# EAGLE design ardIOExp (EAGLE 7.2.0)
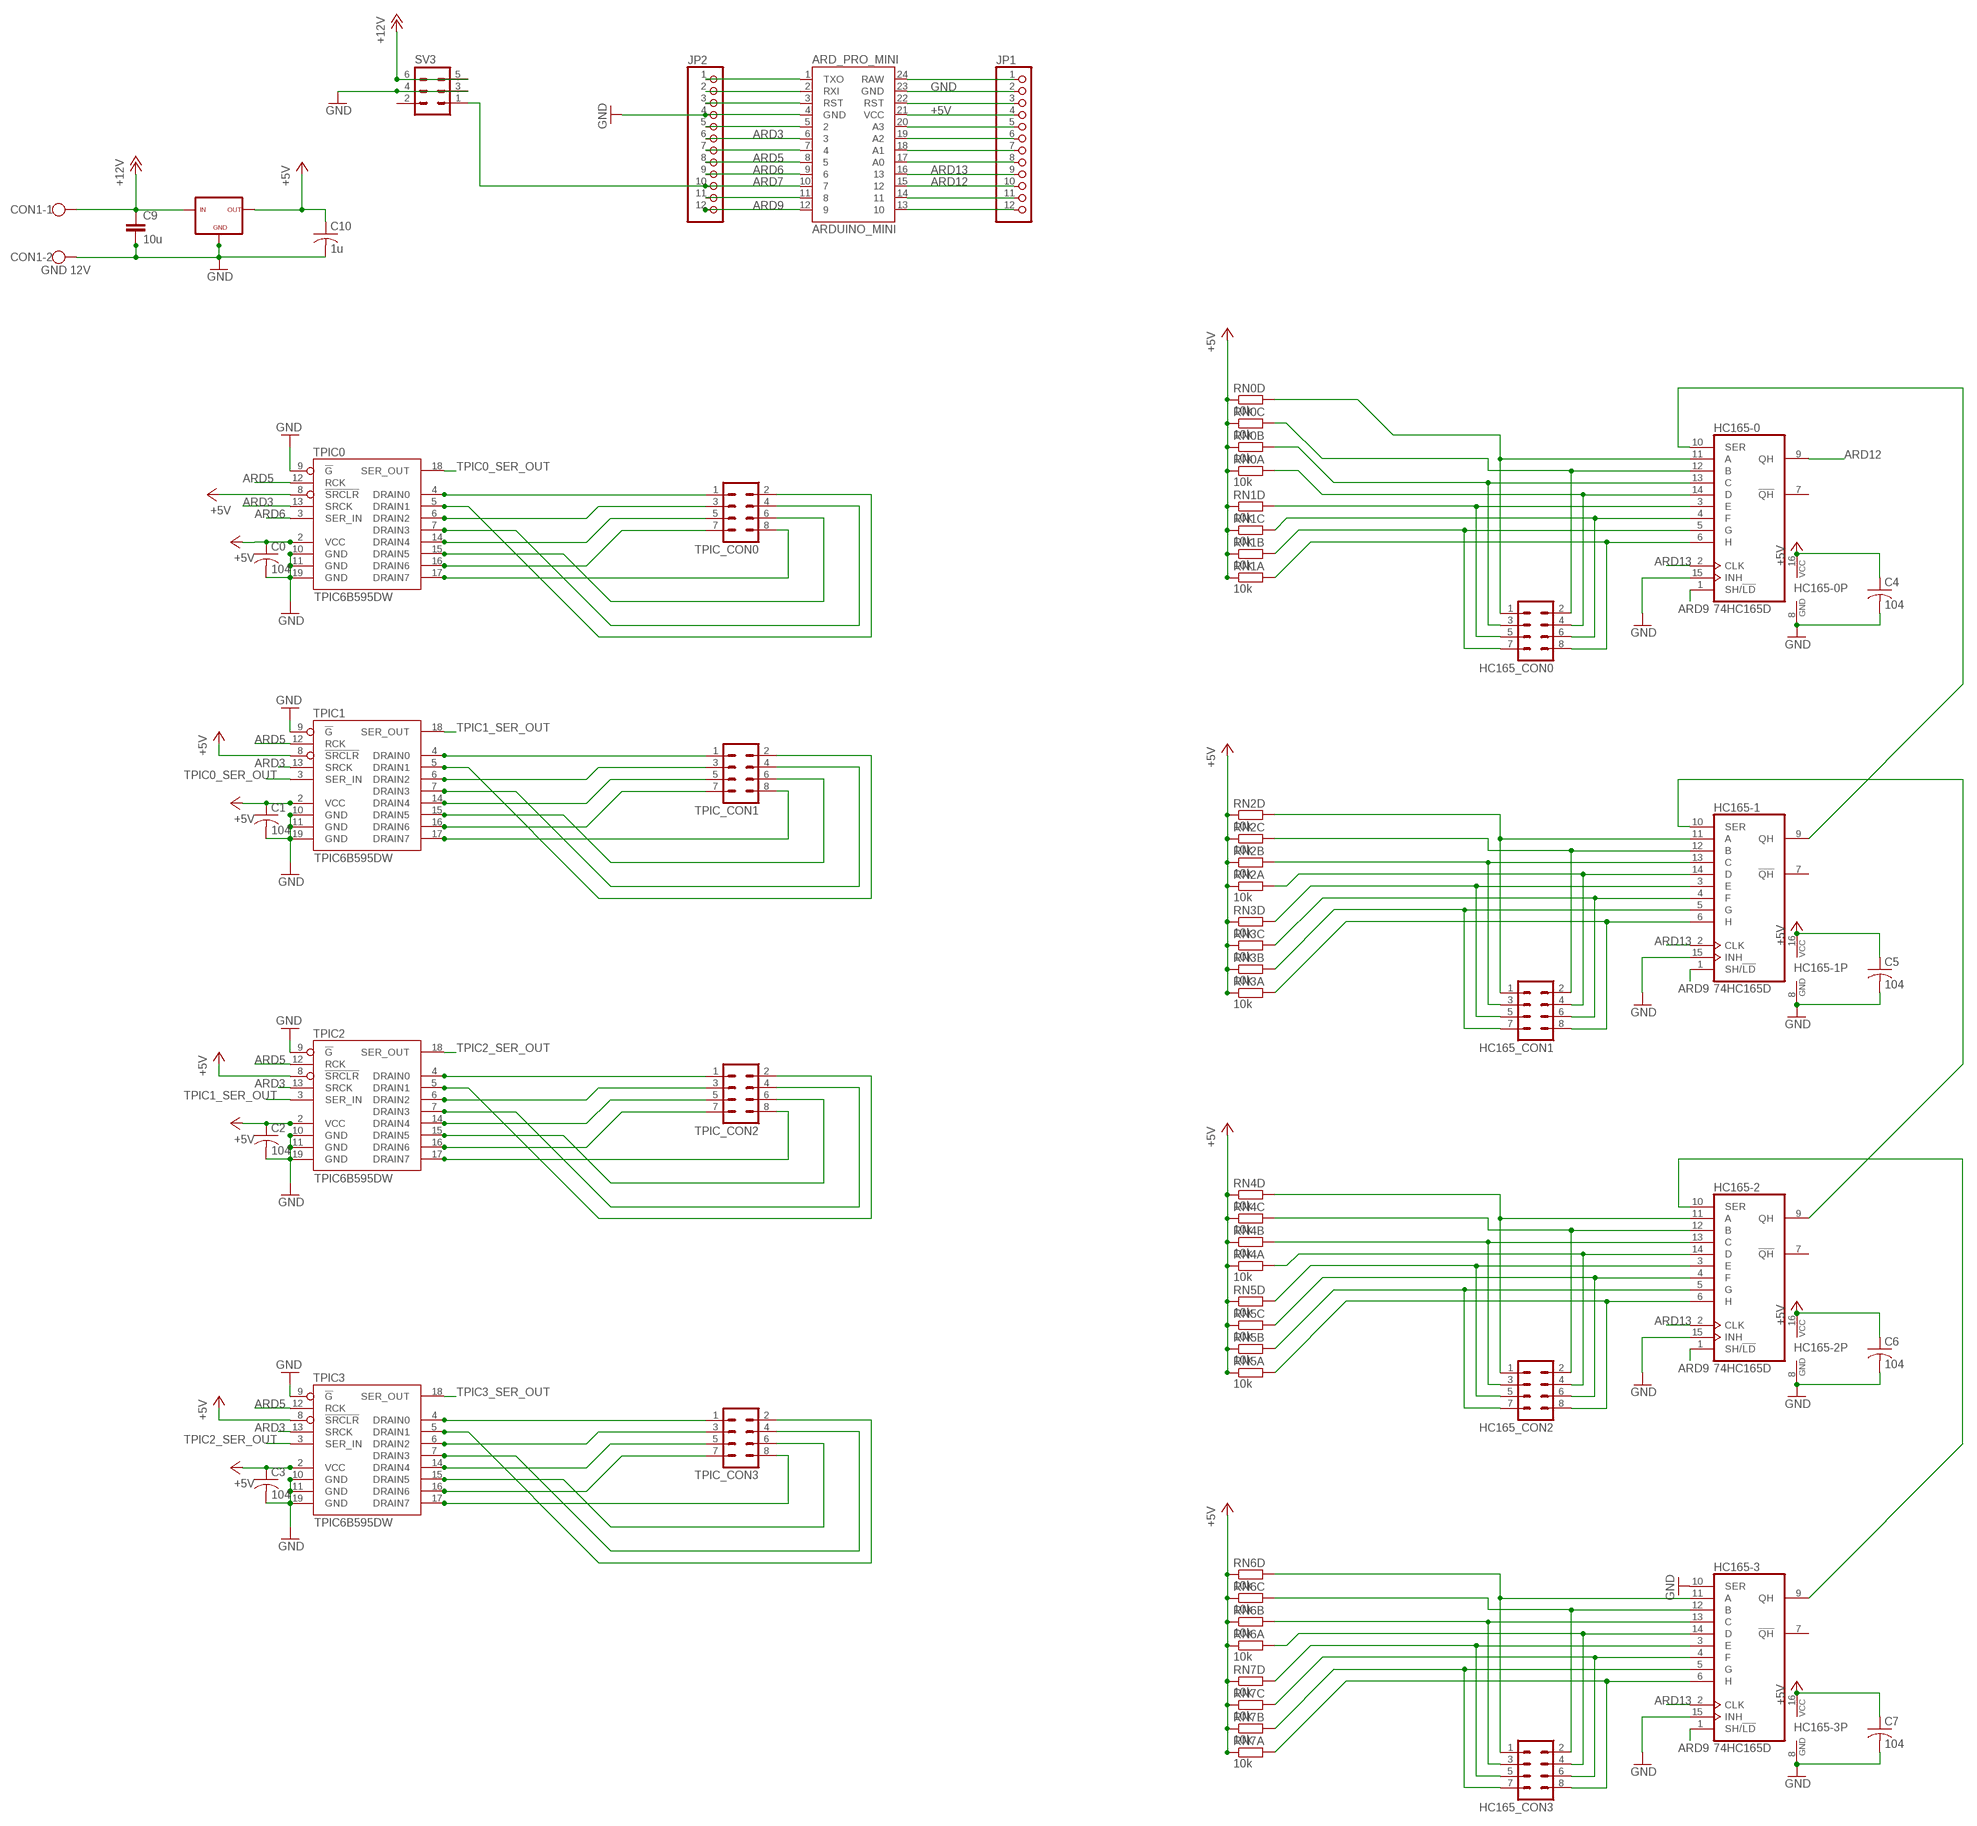
[diagram p0: schematic, sheet 1]

## Parts
ARD_PRO_MINI  ARDUINO_MINI  [ARDUINO_MINI]
C0  104  C-USC0603  [C0603]
C1  104  C-USC0603  [C0603]
C2  104  C-USC0603  [C0603]
C3  104  C-USC0603  [C0603]
C4  104  C-USC0603  [C0603]
C5  104  C-USC0603  [C0603]
C6  104  C-USC0603  [C0603]
C7  104  C-USC0603  [C0603]
C9  10u  C-EU050-024X044  [C050-024X044]
C10  1u  C-USC0805  [C0805]
CON1  GND 12V  W237-102  [W237-102]
HC165-0  74HC165D  [SO16]
HC165-1  74HC165D  [SO16]
HC165-2  74HC165D  [SO16]
HC165-3  74HC165D  [SO16]
HC165_CON0  MA04-2  [MA04-2]
HC165_CON1  MA04-2  [MA04-2]
HC165_CON2  MA04-2  [MA04-2]
HC165_CON3  MA04-2  [MA04-2]
JP1  PINHD-1X12-CB  [1X12-CB]
JP2  PINHD-1X12-CB  [1X12-CB]
RN0  10k  RESISTOR_ARRAY_4  [RN8P-4R-CRA06S]
RN1  10k  RESISTOR_ARRAY_4  [RN8P-4R-CRA06S]
RN2  10k  RESISTOR_ARRAY_4  [RN8P-4R-CRA06S]
RN3  10k  RESISTOR_ARRAY_4  [RN8P-4R-CRA06S]
RN4  10k  RESISTOR_ARRAY_4  [RN8P-4R-CRA06S]
RN5  10k  RESISTOR_ARRAY_4  [RN8P-4R-CRA06S]
RN6  10k  RESISTOR_ARRAY_4  [RN8P-4R-CRA06S]
RN7  10k  RESISTOR_ARRAY_4  [RN8P-4R-CRA06S]
SV3  MA03-2  [MA03-2]
TPIC0  TPIC6B595DW  [SO20W]
TPIC1  TPIC6B595DW  [SO20W]
TPIC2  TPIC6B595DW  [SO20W]
TPIC3  TPIC6B595DW  [SO20W]
TPIC_CON0  MA04-2  [MA04-2]
TPIC_CON1  MA04-2  [MA04-2]
TPIC_CON2  MA04-2  [MA04-2]
TPIC_CON3  MA04-2  [MA04-2]
V_REG_5V  L78D2TT  [D2PAK]

## Nets
+5V: ARD_PRO_MINI.21(VCC) C0.1 C1.1 C2.1 C3.1 C4.1 C5.1 C6.1 C7.1 C10.1 HC165-0.16(VCC) HC165-1.16(VCC) HC165-2.16(VCC) HC165-3.16(VCC) JP1.4 RN0.1 RN0.2 RN0.3 RN0.4 RN1.1 RN1.2 RN1.3 RN1.4 RN2.1 RN2.2 RN2.3 RN2.4 RN3.1 RN3.2 RN3.3 RN3.4 RN4.1 RN4.2 RN4.3 RN4.4 RN5.1 RN5.2 RN5.3 RN5.4 RN6.1 RN6.2 RN6.3 RN6.4 RN7.1 RN7.2 RN7.3 RN7.4 TPIC0.2(VCC) TPIC0.8(!SRCLR) TPIC1.2(VCC) TPIC1.8(!SRCLR) TPIC2.2(VCC) TPIC2.8(!SRCLR) TPIC3.2(VCC) TPIC3.8(!SRCLR) V_REG_5V.3(OUT)
+12V: C9.1 CON1.1 SV3.5 SV3.6 V_REG_5V.1(IN)
ARD3: ARD_PRO_MINI.6 JP2.6 TPIC0.13(SRCK) TPIC1.13(SRCK) TPIC2.13(SRCK) TPIC3.13(SRCK)
ARD5: ARD_PRO_MINI.8 JP2.8 TPIC0.12(RCK) TPIC1.12(RCK) TPIC2.12(RCK) TPIC3.12(RCK)
ARD6: ARD_PRO_MINI.9 JP2.9 TPIC0.3(SER_IN)
ARD7: ARD_PRO_MINI.10 JP2.10 SV3.1
ARD9: ARD_PRO_MINI.12 HC165-0.1(SH/!LD) HC165-1.1(SH/!LD) HC165-2.1(SH/!LD) HC165-3.1(SH/!LD) JP2.12
ARD12: ARD_PRO_MINI.15 HC165-0.9(QH) JP1.10
ARD13: ARD_PRO_MINI.16 HC165-0.2(CLK) HC165-1.2(CLK) HC165-2.2(CLK) HC165-3.2(CLK) JP1.9
GND: ARD_PRO_MINI.4(GND) ARD_PRO_MINI.23(GND) C0.2 C1.2 C2.2 C3.2 C4.2 C5.2 C6.2 C7.2 C9.2 C10.2 CON1.2 HC165-0.8(GND) HC165-0.15(INH) HC165-1.8(GND) HC165-1.15(INH) HC165-2.8(GND) HC165-2.15(INH) HC165-3.8(GND) HC165-3.10(SER) HC165-3.15(INH) JP1.2 JP2.4 SV3.3 SV3.4 TPIC0.9(!G) TPIC0.10(GND) TPIC0.11(GND) TPIC0.19(GND) TPIC1.9(!G) TPIC1.10(GND) TPIC1.11(GND) TPIC1.19(GND) TPIC2.9(!G) TPIC2.10(GND) TPIC2.11(GND) TPIC2.19(GND) TPIC3.9(!G) TPIC3.10(GND) TPIC3.11(GND) TPIC3.19(GND) V_REG_5V.2(GND)
N$2: TPIC0.4(DRAIN0) TPIC_CON0.1
N$3: TPIC0.5(DRAIN1) TPIC_CON0.2
N$5: TPIC0.6(DRAIN2) TPIC_CON0.3
N$6: TPIC0.7(DRAIN3) TPIC_CON0.4
N$7: TPIC0.14(DRAIN4) TPIC_CON0.5
N$8: TPIC0.16(DRAIN6) TPIC_CON0.7
N$9: TPIC0.15(DRAIN5) TPIC_CON0.6
N$10: TPIC0.17(DRAIN7) TPIC_CON0.8
N$11: TPIC1.4(DRAIN0) TPIC_CON1.1
N$12: TPIC1.5(DRAIN1) TPIC_CON1.2
N$13: TPIC1.6(DRAIN2) TPIC_CON1.3
N$14: TPIC1.7(DRAIN3) TPIC_CON1.4
N$15: TPIC1.14(DRAIN4) TPIC_CON1.5
N$16: TPIC1.16(DRAIN6) TPIC_CON1.7
N$17: TPIC1.15(DRAIN5) TPIC_CON1.6
N$18: TPIC1.17(DRAIN7) TPIC_CON1.8
N$19: TPIC2.4(DRAIN0) TPIC_CON2.1
N$21: TPIC2.6(DRAIN2) TPIC_CON2.3
N$22: TPIC2.7(DRAIN3) TPIC_CON2.4
N$23: TPIC2.5(DRAIN1) TPIC_CON2.2
N$25: TPIC2.16(DRAIN6) TPIC_CON2.7
N$26: HC165-0.5(G) HC165_CON0.7 RN1.7
N$29: TPIC3.6(DRAIN2) TPIC_CON3.3
N$31: TPIC2.14(DRAIN4) TPIC_CON2.5
N$32: TPIC2.15(DRAIN5) TPIC_CON2.6
N$33: TPIC2.17(DRAIN7) TPIC_CON2.8
N$34: HC165-0.3(E) HC165_CON0.5 RN1.5
N$36: HC165-0.6(H) HC165_CON0.8 RN1.8
N$37: HC165-0.13(C) HC165_CON0.3 RN0.7
N$38: HC165-0.12(B) HC165_CON0.2 RN0.6
N$39: HC165-0.14(D) HC165_CON0.4 RN0.8
N$40: ARD_PRO_MINI.1(TXO) JP2.1
N$41: HC165-0.11(A) HC165_CON0.1 RN0.5
N$42: ARD_PRO_MINI.7 JP2.7
N$43: HC165-1.11(A) HC165_CON1.1 RN2.5
N$44: HC165-1.12(B) HC165_CON1.2 RN2.6
N$45: HC165-1.13(C) HC165_CON1.3 RN2.7
N$46: HC165-1.14(D) HC165_CON1.4 RN2.8
N$47: HC165-1.3(E) HC165_CON1.5 RN3.5
N$48: HC165-1.4(F) HC165_CON1.6 RN3.6
N$49: HC165-2.11(A) HC165_CON2.1 RN4.5
N$50: HC165-2.14(D) HC165_CON2.4 RN4.8
N$51: HC165-0.10(SER) HC165-1.9(QH)
N$53: HC165-2.12(B) HC165_CON2.2 RN4.6
N$54: HC165-2.13(C) HC165_CON2.3 RN4.7
N$56: HC165-2.3(E) HC165_CON2.5 RN5.5
N$57: HC165-2.4(F) HC165_CON2.6 RN5.6
N$58: HC165-1.10(SER) HC165-2.9(QH)
N$59: HC165-2.10(SER) HC165-3.9(QH)
N$60: HC165-3.14(D) HC165_CON3.4 RN6.8
N$61: HC165-3.11(A) HC165_CON3.1 RN6.5
N$62: HC165-3.12(B) HC165_CON3.2 RN6.6
N$63: HC165-3.13(C) HC165_CON3.3 RN6.7
N$64: HC165-3.5(G) HC165_CON3.7 RN7.7
N$65: HC165-3.6(H) HC165_CON3.8 RN7.8
N$67: HC165-3.3(E) HC165_CON3.5 RN7.5
N$68: HC165-3.4(F) HC165_CON3.6 RN7.6
N$70: TPIC3.7(DRAIN3) TPIC_CON3.4
N$71: TPIC3.5(DRAIN1) TPIC_CON3.2
N$72: TPIC3.4(DRAIN0) TPIC_CON3.1
N$73: TPIC3.15(DRAIN5) TPIC_CON3.6
N$74: TPIC3.14(DRAIN4) TPIC_CON3.5
N$75: TPIC3.16(DRAIN6) TPIC_CON3.7
N$76: TPIC3.17(DRAIN7) TPIC_CON3.8
N$77: ARD_PRO_MINI.2(RXI) JP2.2
N$78: ARD_PRO_MINI.3(RST) JP2.3
N$80: ARD_PRO_MINI.5 JP2.5
N$82: HC165-1.5(G) HC165_CON1.7 RN3.7
N$83: ARD_PRO_MINI.11 JP2.11
N$84: ARD_PRO_MINI.24(RAW) JP1.1
N$85: ARD_PRO_MINI.22(RST) JP1.3
N$87: HC165-0.4(F) HC165_CON0.6 RN1.6
N$88: ARD_PRO_MINI.20(A3) JP1.5
N$89: ARD_PRO_MINI.19(A2) JP1.6
N$90: ARD_PRO_MINI.18(A1) JP1.7
N$91: ARD_PRO_MINI.17(A0) JP1.8
N$92: ARD_PRO_MINI.14 JP1.11
N$93: ARD_PRO_MINI.13 JP1.12
N$95: HC165-2.5(G) HC165_CON2.7 RN5.7
N$96: HC165-2.6(H) HC165_CON2.8 RN5.8
N$97: HC165-1.6(H) HC165_CON1.8 RN3.8
TPIC0_SER_OUT: TPIC0.18(SER_OUT) TPIC1.3(SER_IN)
TPIC1_SER_OUT: TPIC1.18(SER_OUT) TPIC2.3(SER_IN)
TPIC2_SER_OUT: TPIC2.18(SER_OUT) TPIC3.3(SER_IN)
TPIC3_SER_OUT: TPIC3.18(SER_OUT)
Unconnected: HC165-0.7(!QH) HC165-1.7(!QH) HC165-2.7(!QH) HC165-3.7(!QH) SV3.2

## Library data of the parts
ARD_PRO_MINI = SparkFun-Boards:ARDUINO_MINI: Arduino Pro Mini footprint
C0 C1-C7 C10 = rcl:C-US: CAPACITOR, American symbol
C9 = resistor:C-EU: CAPACITOR, European symbol
CON1 = con-wago-500:W237-102: WAGO SCREW CLAMP; MPN: 237-102; OC_FARNELL: unknown; OC_NEWARK: 70K9898
HC165-0 HC165-1-HC165-3 = 74xx-eu:74*165: 8-bit parallel load SHIFT REGISTER
HC165_CON0 HC165_CON1-HC165_CON3 TPIC_CON0 TPIC_CON1-TPIC_CON3 = con-lstb:MA04-2: PIN HEADER; OC_FARNELL: unknown; OC_NEWARK: unknown
JP1 JP2 = adafruit:PINHD-1X12: PIN HEADER
RN0 RN1-RN7 = dp_devices:RESISTOR_ARRAY_4: 4 Resistor Array 0603
SV3 = con-lstb:MA03-2: PIN HEADER; OC_FARNELL: unknown; OC_NEWARK: unknown
TPIC0 TPIC1-TPIC3 = TPIC6B595:TPIC6B595
V_REG_5V = L78:L78

## Net classes
1 power: width 0.61 mm

## Board
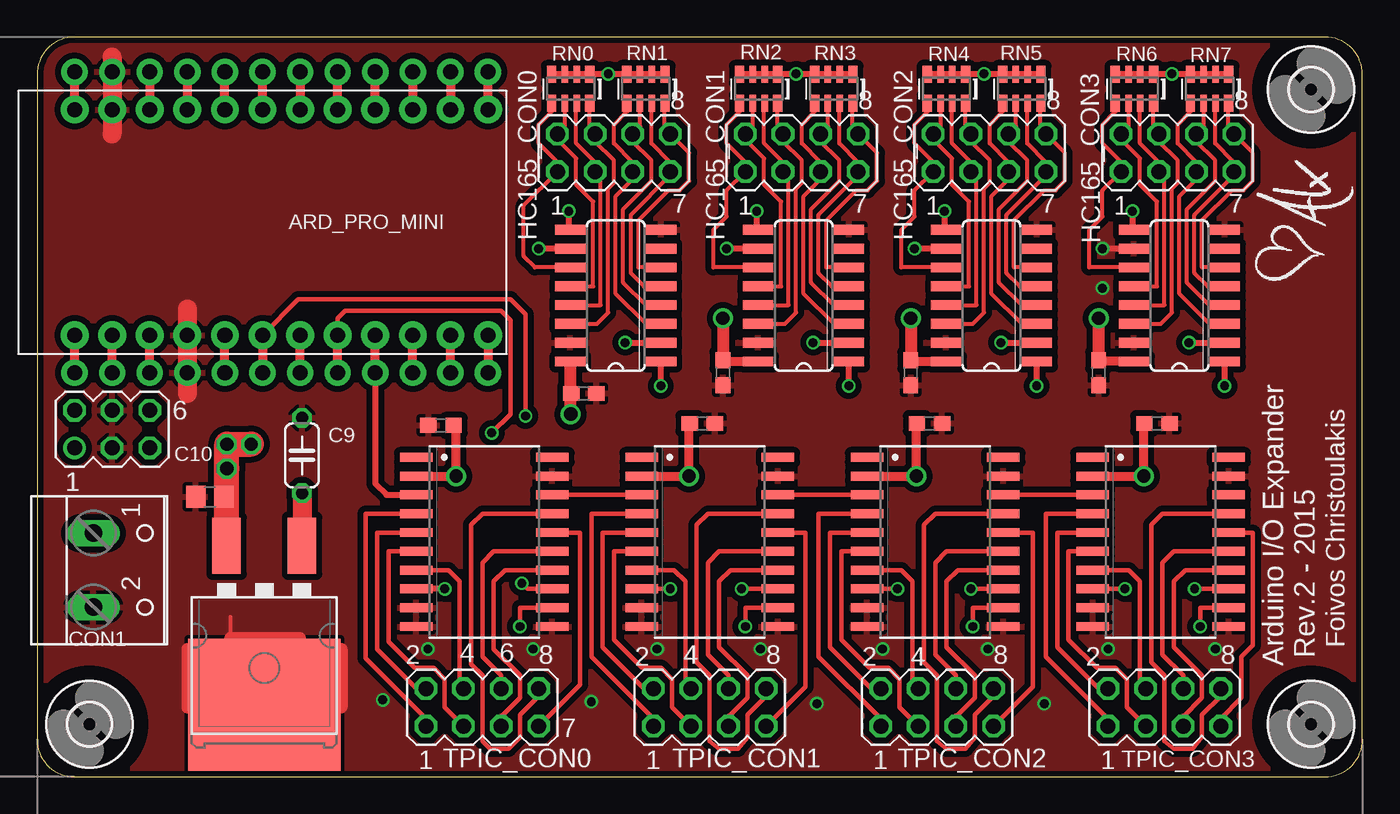
[diagram p1: board, top side]
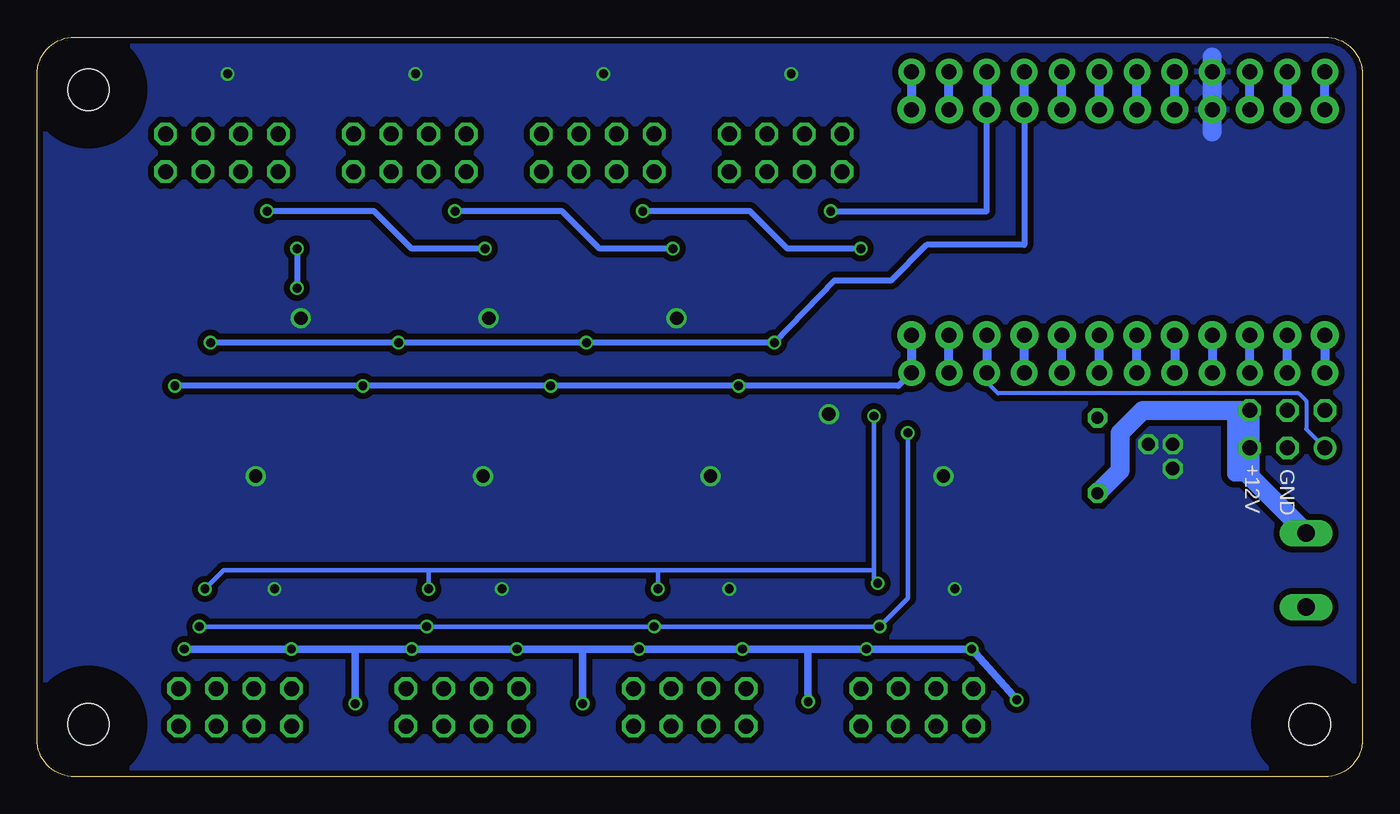
[diagram p2: board, bottom side, seen from below]

Size 89.59 x 49.99 mm. Coordinates in mm from the lower left corner, seen from the top.
Outline: 0,47.45 0,2.54 arc90 2.54,0 87.05,0 arc90 89.59,2.54 89.59,47.45 arc90 87.05,49.99 2.54,49.99 arc90 0,47.45
Copper layers (1*16): Top 0.035mm / dielectric 1.5mm / Bottom 0.035mm
Design rules "ITEADstudio_DRC": minimum track width 6mil, minimum drill 12mil, track to track 6mil, track to pad 6mil, pad to pad 6mil, via to via 6mil, smd to smd 0mil, copper to edge 10mil, drill to drill 10mil, minimum pad ring 10mil, minimum via ring 6mil, stop-mask expansion 2mil, vias tented up to drill 100mil, thermal gap 10mil

### Footprints (pad centres in the part's own frame; a part is rotated, then mirrored left to right if it is on the bottom)
ARDUINO_MINI = drill 1.016 pad 1.88: 1 -7.62,12.7; 2 -7.62,10.16; 3 -7.62,7.62; 4 -7.62,5.08; 5 -7.62,2.54; 6 -7.62,0; 7 -7.62,-2.54; 8 -7.62,-5.08; 9 -7.62,-7.62; 10 -7.62,-10.16; 11 -7.62,-12.7; 12 -7.62,-15.24; 13 7.62,-15.24; 14 7.62,-12.7; 15 7.62,-10.16; 16 7.62,-7.62; 17 7.62,-5.08; 18 7.62,-2.54; 19 7.62,0; 20 7.62,2.54; 21 7.62,5.08; 22 7.62,7.62; 23 7.62,10.16; 24 7.62,12.7
C0603 = smd 1.1 x 1: 1 -0.85,0; 2 0.85,0
C050-024X044 = drill 0.813 octagon: 1 -2.54,0; 2 2.54,0
C0805 = smd 1.3 x 1.5: 1 -0.95,0; 2 0.95,0
W237-102 = drill 1.194 long: 1 -2.5,-1.27; 2 2.5,-1.27
SO16 = smd 0.66 x 2.032: 1 -4.445,-3.073; 2 -3.175,-3.073; 3 -1.905,-3.073; 4 -0.635,-3.073; 5 0.635,-3.073; 6 1.905,-3.073; 7 3.175,-3.073; 8 4.445,-3.073; 9 4.445,3.073; 10 3.175,3.073; 11 1.905,3.073; 12 0.635,3.073; 13 -0.635,3.073; 14 -1.905,3.073; 15 -3.175,3.073; 16 -4.445,3.073
MA04-2 = drill 1.016 octagon: 1 -3.81,-1.27; 2 -3.81,1.27; 3 -1.27,-1.27; 4 -1.27,1.27; 5 1.27,-1.27; 6 1.27,1.27; 7 3.81,-1.27; 8 3.81,1.27
1X12-CB = drill 1.016 pad 1.778: 1 -13.97,0; 2 -11.43,0; 3 -8.89,0; 4 -6.35,0; 5 -3.81,0; 6 -1.27,0; 7 1.27,0; 8 3.81,0; 9 6.35,0; 10 8.89,0; 11 11.43,0; 12 13.97,0
RN8P-4R-CRA06S = smd 0.63 x 1.15: 1 -1.295,-0.975; 4 1.295,-0.975; 5 1.295,0.975; 8 -1.295,0.975 | smd 0.44 x 1.15: 2 -0.4,-0.975; 3 0.4,-0.975; 6 0.4,0.975; 7 -0.4,0.975
MA03-2 = drill 1.016: 1 -2.54,-1.27 | drill 1.016 octagon: 2 -2.54,1.27; 3 0,-1.27; 4 0,1.27; 5 2.54,-1.27; 6 2.54,1.27
SO20W = smd 0.6 x 2.2: 1 -5.715,-4.6; 2 -4.445,-4.6; 3 -3.175,-4.6; 4 -1.905,-4.6; 5 -0.635,-4.6; 6 0.635,-4.6; 7 1.905,-4.6; 8 3.175,-4.6; 9 4.445,-4.6; 10 5.715,-4.6; 11 5.715,4.6; 12 4.445,4.6; 13 3.175,4.6; 14 1.905,4.6; 15 0.635,4.6; 16 -0.635,4.6; 17 -1.905,4.6; 18 -3.175,4.6; 19 -4.445,4.6; 20 -5.715,4.6
2,8 = hole 2.8: 0,0
D2PAK = smd 1.93 x 3.81: 1 -2.55,-8.25; 3 2.55,-8.25 | smd 10.3 x 8.9: 2 0,2.5

### Placement (x,y rotation side)
ARD_PRO_MINI  15.24,37.47 90 top
C0  27.3,23.75 180 top
C1  44.96,23.88 0 top
C2  60.33,23.88 0 top
C3  75.69,23.88 0 top
C4  36.96,25.91 0 top
C5  46.35,27.3 270 top
C6  59.05,27.3 270 top
C7  71.75,27.3 270 top
C9  17.91,21.72 90 top
C10  11.68,18.92 180 top
CON1  5.08,13.97 270 top
HC165-0  39.12,32.51 90 top
HC165-1  51.82,32.51 90 top
HC165-2  64.52,32.51 90 top
HC165-3  77.22,32.51 90 top
HC165_CON0  38.99,42.16 0 top
HC165_CON1  51.69,42.16 0 top
HC165_CON2  64.39,42.16 0 top
HC165_CON3  77.09,42.16 0 top
JP1  16.51,47.62 0 top
JP2  16.51,27.3 0 top
RN0  36.07,46.48 180 top
RN1  41.15,46.48 180 top
RN2  48.77,46.48 180 top
RN3  53.85,46.48 180 top
RN4  61.47,46.48 180 top
RN5  66.55,46.48 180 top
RN6  74.17,46.48 180 top
RN7  79.25,46.48 180 top
SV3  5.08,23.5 0 top
TPIC0  30.23,15.88 270 top
TPIC1  45.47,15.88 270 top
TPIC2  60.71,15.88 270 top
TPIC3  75.95,15.88 270 top
TPIC_CON0  30.1,4.7 0 top
TPIC_CON1  45.47,4.7 0 top
TPIC_CON2  60.83,4.7 0 top
TPIC_CON3  76.2,4.7 0 top
U$1  [2,8]  3.56,3.56 0 top
U$3  [2,8]  86.11,46.43 0 top
U$4  [2,8]  86.11,3.56 0 top
U$6  [HALX2_532_SILKSCREEN]  87,34.16 90 top
U$7  [HALX2_532_TSTOP]  5.59,35.81 0 top
V_REG_5V  15.37,7.37 180 top

### Tracks (layer width: path | path; a pad name or v marks a point on that pad's centre or on a via)
+5V  (via drill 0.6, 0.9)
  Top 0.254: HC165-0.16 36.04,27.96 36.07,27.94 | TPIC0.2 25.78,20.32 | TPIC1.2 40.89,20.32 | 41.02,12.7 TPIC1.8 | TPIC2.2 56.26,20.32 | TPIC2.8 56.39,12.7 | TPIC3.2 71.63,20.32 | TPIC3.8 71.75,12.7 | C0.1 28.32,23.75 | C2.1 59.44,23.88 | 74.8,23.88 C3.1
  Top 0.305: v42.8,12.7 41.02,12.7 | v58.17,12.7 56.39,12.7 | v73.53,12.7 71.75,12.7
  Top 0.406: v27.56,12.7 TPIC0.8 25.4,12.7 | 73.79,47.5 72.9,47.5 72.9,47.46 RN6.4 | 73.79,47.5 74.55,47.5 | 74.55,47.5 75.44,47.5 | 75.44,47.5 v76.71,47.5 77.98,47.5 | 77.98,47.5 78.87,47.5 | 78.87,47.5 79.63,47.5 | 79.63,47.5 80.52,47.5 80.52,47.46 RN7.1 | 61.09,47.5 60.17,47.5 RN4.4 | 61.09,47.5 61.85,47.5 | 61.85,47.5 62.74,47.5 | 62.74,47.5 v64.01,47.5 65.28,47.5 | 65.28,47.5 66.17,47.5 | 66.17,47.5 66.93,47.5 | 66.93,47.5 67.82,47.5 67.82,47.46 RN5.1 | 48.39,47.5 47.47,47.5 RN2.4 | 48.39,47.5 49.15,47.5 | 49.15,47.5 50.04,47.5 | 50.04,47.5 v51.31,47.5 52.58,47.5 | 52.58,47.5 53.47,47.5 | 53.47,47.5 54.23,47.5 | 54.23,47.5 55.14,47.5 RN3.1 | 35.69,47.5 34.77,47.5 RN0.4 | 35.69,47.5 36.45,47.5 | 36.45,47.5 37.21,47.5 | 37.21,47.5 v38.61,47.5 39.88,47.5 | 39.88,47.5 40.64,47.5 | 40.64,47.5 41.53,47.5 | 41.53,47.5 42.44,47.5 RN1.1 | V_REG_5V.3 | C4.1 36.07,25.91 v36.07,24.51 | 44.07,23.88 C1.1 | HC165-3.16 74.04,28.07 | RN7.4 77.98,47.46 77.98,47.5 | RN7.2 79.63,47.46 79.63,47.5 | RN7.3 78.87,47.46 78.87,47.5 | RN6.1 75.44,47.46 75.44,47.5 | RN6.3 73.79,47.46 73.79,47.5 | RN6.2 74.55,47.46 74.55,47.5 | RN5.4 65.28,47.46 65.28,47.5 | RN5.3 66.17,47.46 66.17,47.5 | RN5.2 66.93,47.46 66.93,47.5 | RN4.3 61.09,47.46 61.09,47.5 | RN4.2 61.85,47.46 61.85,47.5 | RN4.1 62.74,47.46 62.74,47.5 | RN2.3 48.39,47.46 48.39,47.5 | RN2.2 49.15,47.46 49.15,47.5 | RN2.1 50.04,47.46 50.04,47.5 | RN0.3 35.69,47.46 35.69,47.5 | RN0.2 36.45,47.46 36.45,47.5 | RN0.1 37.21,47.46 37.21,47.5 | RN1.4 39.88,47.46 39.88,47.5 | RN1.3 40.64,47.46 40.64,47.5 | RN1.2 41.53,47.46 41.53,47.5 | RN3.4 52.58,47.46 52.58,47.5 | RN3.3 53.47,47.46 53.47,47.5 | RN3.2 54.23,47.46 54.23,47.5
  Top 0.61: 40.89,20.32 v44.07,20.32 44.07,23.88 | 25.78,20.32 v28.32,20.32 28.32,23.75 | 56.26,20.32 v59.44,20.32 59.44,23.88 | 71.63,20.32 v74.8,20.32 74.8,23.88 | JP1.4 ARD_PRO_MINI.21 | 61.47,28.07 HC165-2.16 59.05,28.07 59.05,27.94 | 46.35,28.07 HC165-1.16 48.77,28.07 | 74.04,28.07 71.75,28.07
  Top 0.813: v59.05,30.99 C6.1 59.05,28.07 | v46.35,30.99 C5.1 46.35,28.07 | v36.07,24.51 36.07,27.94 | 71.75,28.07 C7.1 v71.75,30.99
  Top 1.27: C10.1 12.7,18.92 v12.83,20.83
  Top 1.676: V_REG_5V.3 v12.83,20.83 v12.83,22.48 v14.48,22.48
  Bottom 1.27: 10.16,43.56 10.16,48.64
  pour Bottom (isolate 0.406, rank 3): 0,2.54 0,47.45 arc-90 2.54,49.99 87.05,49.99 arc-90 89.59,47.45 89.59,2.54 arc-90 87.05,0 2.54,0 arc-90
+12V
  Top 0.406: 17.91,15.62 V_REG_5V.1
  Top 1.27: C9.1 17.91,15.62
  Bottom 0.254: 3.81,16.51 CON1.1
  Bottom 1.016: 7.62,20.45 8.64,20.45 8.64,24.77
  Bottom 1.27: C9.1 16.38,20.7 16.38,23.24 14.86,24.77 8.64,24.77 SV3.6 SV3.5 7.62,20.45 7.62,20.32 3.81,16.51
ARD3  (via drill 0.6)
  Top 0.254: TPIC0.13 34.67,12.7 | 49.91,12.7 TPIC1.13 | TPIC2.13 65.15,12.7 | TPIC3.13 80.39,12.7
  Top 0.305: 80.39,12.7 v78.23,12.7 | v47.62,12.7 49.91,12.7 | v63.12,12.7 65.15,12.7 | v32.77,13.08 33.15,12.7 34.67,12.7 | v33.02,24.38 33.02,31.24 32,32.26 17.65,32.26 ARD_PRO_MINI.6
  Top 0.61: ARD_PRO_MINI.6 JP2.6
  Bottom 0.305: v78.23,12.7 76.96,13.97 63.12,13.97 | 63.12,13.97 47.62,13.97 | 63.12,13.97 v63.12,12.7 | 47.62,13.97 v47.62,12.7 | 47.62,13.97 33.02,13.97 | 33.02,13.97 33.02,13.34 v32.77,13.08 | v33.02,24.38 33.02,13.97
  Bottom 0.61: JP2.6 ARD_PRO_MINI.6
ARD5  (via drill 0.6)
  Top 0.305: 34.92,11.43 TPIC0.12 32.64,11.43 v32.64,10.16 | 50.16,11.43 TPIC1.12 47.88,11.43 v47.88,10.16 | 65.53,11.43 TPIC2.12 63.25,11.43 v63.25,10.16 | 80.9,11.43 TPIC3.12 78.61,11.43 v78.61,10.16 | ARD_PRO_MINI.8 20.32,30.99 20.83,31.5 31.37,31.5 32,30.86 32,24.51 v30.73,23.24
  Top 0.61: JP2.8 ARD_PRO_MINI.8
  Bottom 0.305: v30.73,23.24 30.73,12.06 v32.64,10.16 v47.88,10.16 v63.25,10.16 v78.61,10.16
  Bottom 0.61: JP2.8 ARD_PRO_MINI.8
ARD6
  Top 0.406: JP2.9 22.86,19.81 23.62,19.05 TPIC0.3 25.65,19.05 25.78,19.05
  Top 0.61: JP2.9 ARD_PRO_MINI.9
  Bottom 0.61: JP2.9 ARD_PRO_MINI.9
ARD7
  Top 0.61: JP2.10 ARD_PRO_MINI.10
  Bottom 0.254: JP2.10 25.4,26.67 24.64,25.91 4.32,25.91 3.81,25.4 3.81,23.5 SV3.1
  Bottom 0.61: ARD_PRO_MINI.10 JP2.10
ARD9  (via drill 0.6)
  Top 0.254: 42.16,28.07 HC165-0.1 | 54.86,28.07 HC165-1.1 | HC165-3.1 80.26,28.07
  Top 0.406: v42.16,26.42 42.16,28.07 | v54.86,26.42 54.86,28.07 | v67.56,26.42 67.56,28.07 HC165-2.1 | v80.26,26.42 80.26,28.07
  Top 0.61: ARD_PRO_MINI.12 JP2.12
  Bottom 0.406: JP2.12 31.37,26.42 v42.16,26.42 v54.86,26.42 v67.56,26.42 v80.26,26.42
  Bottom 0.61: ARD_PRO_MINI.12 JP2.12
ARD12  (via drill 0.6)
  Top 0.254: HC165-0.9 35.94,36.96
  Top 0.406: v35.94,38.23 35.94,36.96
  Top 0.61: JP1.10 ARD_PRO_MINI.15
  Bottom 0.406: 25.4,44.96 ARD_PRO_MINI.15 25.4,38.23 v35.94,38.23
  Bottom 0.61: JP1.10 ARD_PRO_MINI.15
ARD13  (via drill 0.6)
  Top 0.254: HC165-3.2 80.01,29.34 | 54.74,29.34 HC165-1.2 | 42.04,29.34 HC165-0.2
  Top 0.406: v39.75,29.34 42.04,29.34 | v52.45,29.34 54.74,29.34 | v65.15,29.34 HC165-2.2 | v77.85,29.34 80.01,29.34
  Top 0.61: ARD_PRO_MINI.16 JP1.9
  Bottom 0.406: ARD_PRO_MINI.16 22.86,35.94 29.46,35.94 31.88,33.53 35.69,33.53 v39.75,29.34 v52.45,29.34 v65.15,29.34 v77.85,29.34
  Bottom 0.61: ARD_PRO_MINI.16 JP1.9
GND  (via drill 0.6)
  Top 0.254: 13.08,9.4 13.08,10.79
  Top 0.406: 74.42,35.69 v72.01,35.69
  Top 0.61: JP2.4 ARD_PRO_MINI.4
  Top 0.813: 10.16,8.64 10.16,4.7 | 13.08,9.4 17.78,9.4 | 20.57,8.64 20.57,4.7
  Top 1.27: 10.16,31.62 10.16,25.91 | 5.08,48.64 5.08,43.43
  Bottom 0.406: v72.01,35.69 v72.01,33.02
  Bottom 0.508: v23.37,5.21 v26.42,8.64 v33.53,8.64 37.47,8.64 | v48.9,8.64 v41.91,8.64 37.47,8.64 | v48.9,8.64 49.02,8.64 | v64.26,8.64 v57.15,8.64 52.7,8.64 | v64.26,8.64 64.39,8.64 | 79.76,8.64 v79.63,8.64 v72.39,8.64 68.07,8.64 | v37.47,5.08 37.47,8.64 | v48.9,8.64 52.7,8.64 | v52.7,4.95 52.7,8.64 | v64.26,8.64 68.07,8.64 | v68.07,4.95 68.07,8.64
  Bottom 0.61: ARD_PRO_MINI.4 JP2.4 | ARD_PRO_MINI.23 JP1.2
  pour Top (isolate 0.406, rank 3): 0,2.54 0,47.45 arc-90 2.54,49.99 87.05,49.99 arc-90 89.59,47.45 89.59,2.54 arc-90 87.05,0 2.54,0 arc-90
N$2
  Top 0.305: TPIC_CON0.1 26.29,3.94 22.23,8 22.23,17.78 TPIC0.4 25.65,17.78
N$3
  Top 0.305: 25.65,16.51 TPIC0.5 22.99,16.51 22.99,8.64 25.65,5.97 TPIC_CON0.2
N$5
  Top 0.305: TPIC_CON0.3 27.56,4.7 27.56,6.6 26.8,7.37 25.53,7.37 23.75,9.14 23.75,15.24 TPIC0.6 25.65,15.24
N$6
  Top 0.254: 25.65,13.97 TPIC0.7
  Top 0.305: TPIC_CON0.4 28.57,6.22 28.57,13.21 27.81,13.97 25.65,13.97
N$7
  Top 0.305: 35.18,13.97 34.92,13.97 TPIC0.14 31.62,13.97 30.86,13.21 30.86,8.64 32.64,6.86 32.64,5.33 31.37,4.06
  Top 0.406: TPIC_CON0.5 31.37,4.06
N$8
  Top 0.305: 34.8,16.51 TPIC0.16 36.7,16.51 36.7,6.22 TPIC_CON0.7
N$9
  Top 0.254: TPIC0.15 34.8,15.24
  Top 0.305: 34.8,15.24 30.86,15.24 30.1,14.48 30.1,8.13 31.37,6.86 TPIC_CON0.6
N$10
  Top 0.254: TPIC0.17 34.8,17.78
  Top 0.305: 34.8,17.78 30.1,17.78 29.34,17.02 29.34,7.62 30.1,6.86 30.1,2.41 30.61,1.91 31.88,1.91 32.64,2.67 32.64,4.19 33.91,5.46
  Top 0.406: 33.91,5.46 TPIC_CON0.8
N$11
  Top 0.305: TPIC_CON1.1 41.66,3.94 37.47,8.13 37.47,17.78 TPIC1.4 40.89,17.78 41.02,17.78
N$12
  Top 0.305: 41.02,16.51 TPIC1.5 38.23,16.51 38.23,8.76 41.02,5.97 TPIC_CON1.2
N$13
  Top 0.305: TPIC_CON1.3 42.93,4.7 42.93,6.6 42.16,7.37 40.89,7.37 38.99,9.27 38.99,15.24 TPIC1.6 40.89,15.24 41.02,15.24
N$14
  Top 0.254: 41.02,13.97 TPIC1.7
  Top 0.305: TPIC_CON1.4 43.81,6.35 43.81,13.21 43.05,13.97 41.02,13.97
N$15
  Top 0.305: 46.74,4.06 48.01,5.33 48.01,6.86 46.1,8.76 46.1,13.21 46.86,13.97 50.04,13.97 TPIC1.14 50.55,13.97
  Top 0.406: TPIC_CON1.5 46.74,4.06
N$16
  Top 0.254: TPIC1.16 50.16,16.51
  Top 0.305: 50.16,16.51 51.94,16.51 51.94,6.1 TPIC_CON1.7
N$17
  Top 0.305: 50.16,15.24 TPIC1.15 50.04,15.24 46.1,15.24 45.34,14.48 45.34,8.26 46.74,6.86 TPIC_CON1.6
N$18
  Top 0.305: 50.16,17.78 TPIC1.17 50.04,17.78 45.34,17.78 44.58,17.02 44.58,7.75 45.47,6.86 45.47,2.41 46.1,1.91 47.37,1.91 48.01,2.67 48.01,4.19 49.28,5.46
  Top 0.406: 49.28,5.46 TPIC_CON1.8
N$19
  Top 0.305: TPIC_CON2.1 57.02,3.94 52.83,8.13 52.83,17.78 TPIC2.4 56.39,17.78
N$21
  Top 0.305: TPIC_CON2.3 58.29,4.7 58.29,6.6 57.53,7.37 56.26,7.37 54.36,9.27 54.36,15.24 TPIC2.6 56.13,15.24 56.39,15.24
N$22
  Top 0.254: 56.39,13.97 TPIC2.7
  Top 0.305: TPIC_CON2.4 59.18,6.35 59.18,13.21 58.42,13.97 56.39,13.97
N$23
  Top 0.305: 56.39,16.51 56.13,16.51 TPIC2.5 53.59,16.51 53.59,8.76 56.39,5.97 TPIC_CON2.2
N$25
  Top 0.254: TPIC2.16 65.53,16.51
  Top 0.305: 65.53,16.51 67.31,16.51 67.31,6.1 TPIC_CON2.7
N$26
  Top 0.254: 41.53,45.47 41.53,42.8 42.8,41.53 HC165_CON0.7 42.8,40.64 40.13,37.97 40.13,34.04 41.02,33.15 HC165-0.5
  Top 0.406: 41.53,45.47 41.55,45.47 RN1.7
N$29
  Top 0.305: TPIC_CON3.3 73.66,4.7 73.66,6.6 72.9,7.37 71.63,7.37 69.72,9.27 69.72,15.24 TPIC3.6 71.5,15.24 71.75,15.24
N$31
  Top 0.305: 62.1,4.06 63.37,5.33 63.37,6.86 61.47,8.76 61.47,13.21 62.23,13.97 TPIC2.14 65.41,13.97 65.91,13.97
  Top 0.406: TPIC_CON2.5 62.1,4.06
N$32
  Top 0.305: 65.53,15.24 TPIC2.15 65.28,15.24 61.47,15.24 60.71,14.48 60.71,8.26 62.1,6.86 TPIC_CON2.6
N$33
  Top 0.305: 65.53,17.78 TPIC2.17 65.28,17.78 60.71,17.78 59.94,17.02 59.94,7.75 60.83,6.86 60.83,2.41 61.47,1.91 62.74,1.91 63.37,2.67 63.37,4.19 64.64,5.46
  Top 0.406: 64.64,5.46 TPIC_CON2.8
N$34
  Top 0.254: HC165-0.3 41.15,30.61 39.12,32.64 39.12,39.24 40.26,40.39 HC165_CON0.5 40.26,41.53 38.99,42.8 38.99,44.07 39.88,44.96 39.88,45.47
  Top 0.406: 39.88,45.47 39.85,45.47 RN1.5
N$36
  Top 0.254: 42.42,45.59 42.42,45.47 42.42,43.81 HC165_CON0.8 44.07,42.16 44.07,40.26 43.43,39.62 42.67,39.62 40.64,37.59 40.64,34.42 HC165-0.6
  Top 0.406: 42.29,34.42 HC165-0.6 | RN1.8 42.42,45.51 42.42,45.47
N$37
  Top 0.254: 35.94,31.88 HC165-0.13 | 36.07,31.88 38.1,31.88 38.1,40.51 HC165_CON0.3 37.72,41.53 36.45,42.8 36.45,45.47
  Top 0.406: HC165-0.13 36.07,31.88 | RN0.7 36.45,45.51 36.45,45.47
N$38
  Top 0.254: HC165-0.12 37.59,33.15 37.59,38.86 36.45,40.01 36.45,41.78 35.18,43.05 HC165_CON0.2 35.69,43.94 35.69,45.47
  Top 0.406: RN0.6 35.69,45.51 35.69,45.47
N$39
  Top 0.254: HC165-0.14 37.85,30.61 38.61,31.37 38.61,39.75 38.99,40.13 38.99,41.66 37.72,42.93 HC165_CON0.4 37.34,43.81 37.34,45.47
  Top 0.406: 37.34,45.47 37.36,45.47 RN0.8
N$40
  Top 0.61: JP2.1 ARD_PRO_MINI.1
  Bottom 0.61: ARD_PRO_MINI.1 JP2.1
N$41
  Top 0.254: 34.8,45.47 34.8,44.96 33.91,44.07 33.91,42.8 35.18,41.53 HC165_CON0.1 32.89,38.61 32.89,35.18 33.66,34.42 HC165-0.11 36.07,34.42 36.2,34.42
  Top 0.406: RN0.5 34.8,45.51 34.8,45.47
N$42
  Top 0.61: JP2.7 ARD_PRO_MINI.7
  Bottom 0.61: JP2.7 ARD_PRO_MINI.7
N$43
  Top 0.254: 47.5,45.47 47.5,44.96 46.61,44.07 46.61,42.8 47.88,41.53 HC165_CON1.1 46.61,39.62 46.61,37.85 45.72,36.96 45.72,34.42 HC165-1.11 | 48.9,34.42 48.77,34.42
  Top 0.406: HC165-1.11 48.77,34.42 | RN2.5 47.5,45.51 47.5,45.47
N$44
  Top 0.254: 48.77,33.15 50.29,33.15 50.29,38.86 49.15,40.01 49.15,41.78 47.88,43.05 HC165_CON1.2 48.39,43.94 48.39,45.47
  Top 0.406: 48.77,33.15 HC165-1.12 | RN2.6 48.39,45.51 48.39,45.47
N$45
  Top 0.254: 48.64,31.88 HC165-1.13 | 48.77,31.88 50.8,31.88 50.8,40.51 HC165_CON1.3 50.42,41.53 49.15,42.8 49.15,45.47
  Top 0.406: HC165-1.13 48.77,31.88 | 49.15,45.47 49.17,45.47 RN2.7
N$46
  Top 0.254: 48.77,30.61 50.55,30.61 51.31,31.37 51.31,39.75 51.69,40.13 51.69,41.66 50.42,42.93 HC165_CON1.4 50.04,43.81 50.04,45.47
  Top 0.406: 48.77,30.61 HC165-1.14 | 50.04,45.47 50.06,45.47 RN2.8
N$47
  Top 0.254: HC165-1.3 53.85,30.61 51.82,32.64 51.82,39.24 52.96,40.39 52.96,40.77 HC165_CON1.5 52.96,41.53 51.69,42.8 51.69,44.07 52.58,44.96 52.58,45.47
  Top 0.406: 52.58,45.47 52.55,45.47 RN3.5
N$48
  Top 0.254: HC165-1.4 53.85,31.88 52.32,33.4 52.32,38.35 54.23,40.26 54.23,41.66 52.96,42.93 HC165_CON1.6 53.47,43.94 53.47,45.47
  Top 0.406: 53.47,45.47 53.45,45.47 RN3.6
N$49
  Top 0.254: 60.2,45.47 60.2,44.96 59.31,44.07 59.31,42.8 60.58,41.53 HC165_CON2.1 59.31,39.62 59.31,37.85 58.42,36.96 58.42,34.42 HC165-2.11 | 61.59,34.42 61.47,34.42
  Top 0.406: HC165-2.11 61.47,34.42 | 60.2,45.47 60.17,45.47 RN4.5
N$50
  Top 0.254: 61.47,30.61 63.25,30.61 64.01,31.37 64.01,39.75 64.39,40.13 64.39,41.66 63.12,42.93 HC165_CON2.4 62.74,43.81 62.74,45.47
  Top 0.406: 61.47,30.61 HC165-2.14 | 62.74,45.47 62.76,45.47 RN4.8
N$51  (via drill 0.6)
  Top 0.406: v48.64,38.23 48.64,36.96 HC165-1.9 | 36.32,35.69 36.07,35.69 HC165-0.10 v33.91,35.69
  Bottom 0.406: v33.91,35.69 38.86,35.69 41.4,38.23 v48.64,38.23
N$53
  Top 0.254: 61.47,33.15 62.99,33.15 62.99,38.86 61.85,40.01 61.85,41.78 60.58,43.05 HC165_CON2.2 61.09,43.94 61.09,45.47
  Top 0.406: 61.47,33.15 HC165-2.12 | 61.09,45.47 61.07,45.47 RN4.6
N$54
  Top 0.254: 61.34,31.88 HC165-2.13 | 61.47,31.88 63.5,31.88 63.5,40.51 HC165_CON2.3 63.12,41.53 61.85,42.8 61.85,45.47
  Top 0.406: HC165-2.13 61.47,31.88 | 61.85,45.47 61.87,45.47 RN4.7
N$56
  Top 0.254: 67.44,30.61 66.55,30.61 64.52,32.64 64.52,39.24 65.66,40.39 65.66,40.77 HC165_CON2.5 65.66,41.53 64.39,42.8 64.39,44.07 65.28,44.96 65.28,45.47
  Top 0.406: HC165-2.3 67.44,30.61 | RN5.5 65.28,45.51 65.28,45.47
N$57
  Top 0.254: 67.44,31.88 66.55,31.88 65.02,33.4 65.02,38.35 66.93,40.26 66.93,41.66 65.66,42.93 HC165_CON2.6 66.17,43.94 66.17,45.47
  Top 0.406: 67.44,31.88 HC165-2.4 | 66.17,45.47 66.15,45.47 RN5.6
N$58  (via drill 0.6)
  Top 0.406: v61.34,38.23 61.34,36.96 HC165-2.9 | 49.02,35.69 HC165-1.10 v46.61,35.69
  Bottom 0.406: v46.61,35.69 51.56,35.69 54.1,38.23 v61.34,38.23
N$59  (via drill 0.6)
  Top 0.406: v74.04,38.23 74.04,37.08 74.04,36.96 HC165-3.9 | 61.72,35.69 HC165-2.10 v59.31,35.69
  Bottom 0.406: v59.31,35.69 64.26,35.69 66.8,38.23 v74.04,38.23
N$60
  Top 0.254: 74.17,30.61 75.95,30.61 76.71,31.37 76.71,39.75 77.09,40.13 77.09,41.66 75.82,42.93 HC165_CON3.4 75.44,43.81 75.44,45.47
  Top 0.406: 74.17,30.61 HC165-3.14 | RN6.8 75.44,45.51 75.44,45.47
N$61
  Top 0.254: 72.9,45.47 72.9,44.96 72.01,44.07 72.01,42.8 73.28,41.53 HC165_CON3.1 72.01,39.62 72.01,37.85 71.12,36.96 71.12,34.42 HC165-3.11 | 74.3,34.42 74.17,34.42
  Top 0.406: HC165-3.11 74.17,34.42 | 72.9,45.47 72.87,45.47 RN6.5
N$62
  Top 0.254: 74.17,33.15 75.69,33.15 75.69,38.86 74.55,40.01 74.55,41.78 73.28,43.05 HC165_CON3.2 73.79,43.94 73.79,45.47
  Top 0.406: 74.17,33.15 HC165-3.12 | 73.79,45.47 73.77,45.47 RN6.6
N$63
  Top 0.254: 74.04,31.88 HC165-3.13 | 74.17,31.88 76.2,31.88 76.2,40.51 HC165_CON3.3 75.82,41.53 74.55,42.8 74.55,45.47
  Top 0.406: HC165-3.13 74.17,31.88 | 74.55,45.47 74.57,45.47 RN6.7
N$64
  Top 0.254: 79.63,45.47 79.63,42.8 80.9,41.53 HC165_CON3.7 80.9,40.64 78.23,37.97 78.23,34.04 79.12,33.15 HC165-3.5
  Top 0.406: 79.63,45.47 79.65,45.47 RN7.7
N$65
  Top 0.254: 80.52,45.59 80.52,43.81 HC165_CON3.8 82.17,42.16 82.17,40.26 81.53,39.62 80.77,39.62 78.74,37.59 78.74,34.42 80.26,34.42 | 80.39,34.42 HC165-3.6
  Top 0.406: HC165-3.6 80.26,34.42 | 80.52,45.59 80.54,45.59 RN7.8
N$67
  Top 0.254: HC165-3.3 79.25,30.61 77.22,32.64 77.22,39.24 78.36,40.39 HC165_CON3.5 78.36,41.53 77.09,42.8 77.09,44.07 77.98,44.96 77.98,45.47
  Top 0.406: 77.98,45.47 77.95,45.47 RN7.5
N$68
  Top 0.254: HC165-3.4 79.25,31.88 77.72,33.4 77.72,38.35 79.63,40.26 79.63,41.66 78.36,42.93 HC165_CON3.6 78.87,43.94 78.87,45.47
  Top 0.406: RN7.6 78.87,45.51 78.87,45.47
N$70
  Top 0.254: TPIC3.7 71.75,13.97
  Top 0.305: TPIC_CON3.4 74.55,6.35 74.55,13.21 73.79,13.97 71.75,13.97
N$71
  Top 0.305: 71.75,16.51 71.5,16.51 TPIC3.5 68.96,16.51 68.96,8.76 71.75,5.97 TPIC_CON3.2
N$72
  Top 0.305: TPIC_CON3.1 72.39,3.94 68.2,8.13 68.2,17.78 TPIC3.4 71.37,17.78 71.75,17.78
N$73
  Top 0.305: 80.9,15.24 TPIC3.15 80.52,15.24 76.83,15.24 76.07,14.48 76.07,8.26 77.47,6.86 TPIC_CON3.6
N$74
  Top 0.305: 77.47,4.06 78.74,5.33 78.74,6.86 76.83,8.76 76.83,13.21 77.6,13.97 TPIC3.14 80.64,13.97 81.28,13.97
  Top 0.406: TPIC_CON3.5 77.47,4.06
N$75
  Top 0.254: TPIC3.16 80.9,16.51
  Top 0.305: 80.9,16.51 82.17,16.51 82.17,8.89 81.41,8.13 81.41,5.33 80.01,3.94 TPIC_CON3.7
N$76
  Top 0.305: 80.9,17.78 TPIC3.17 80.52,17.78 76.07,17.78 75.31,17.02 75.31,7.75 76.2,6.86 76.2,2.41 76.83,1.91 78.11,1.91 78.74,2.67 78.74,4.19 80.01,5.46
  Top 0.406: 80.01,5.46 TPIC_CON3.8
N$77
  Top 0.61: JP2.2 ARD_PRO_MINI.2
  Bottom 0.61: JP2.2 ARD_PRO_MINI.2
N$78
  Top 0.61: JP2.3 ARD_PRO_MINI.3
  Bottom 0.61: JP2.3 ARD_PRO_MINI.3
N$80
  Top 0.61: JP2.5 ARD_PRO_MINI.5
  Bottom 0.61: ARD_PRO_MINI.5 JP2.5
N$82
  Top 0.254: 54.23,45.47 54.23,42.8 55.5,41.53 HC165_CON1.7 55.5,40.64 52.83,37.97 52.83,34.04 53.72,33.15 HC165-1.5
  Top 0.406: 54.23,45.47 54.25,45.47 RN3.7
N$83
  Top 0.61: JP2.11 ARD_PRO_MINI.11
  Bottom 0.61: JP2.11 27.94,29.97
N$84
  Top 0.61: ARD_PRO_MINI.24 JP1.1
  Bottom 0.61: ARD_PRO_MINI.24 JP1.1
N$85
  Top 0.61: JP1.3 ARD_PRO_MINI.22
  Bottom 0.61: ARD_PRO_MINI.22 JP1.3
N$87
  Top 0.254: HC165-0.4 41.15,31.88 39.62,33.4 39.62,38.35 41.53,40.26 41.53,41.66 40.26,42.93 HC165_CON0.6 40.77,43.94 40.77,45.47
  Top 0.406: 40.77,45.47 40.75,45.47 RN1.6
N$88
  Top 0.61: ARD_PRO_MINI.20 JP1.5
  Bottom 0.61: ARD_PRO_MINI.20 JP1.5
N$89
  Top 0.61: ARD_PRO_MINI.19 JP1.6
  Bottom 0.61: ARD_PRO_MINI.19 JP1.6
N$90
  Top 0.61: JP1.7 ARD_PRO_MINI.18
  Bottom 0.61: ARD_PRO_MINI.18 JP1.7
N$91
  Top 0.61: ARD_PRO_MINI.17 JP1.8
  Bottom 0.61: ARD_PRO_MINI.17 JP1.8
N$92
  Top 0.61: JP1.11 ARD_PRO_MINI.14
  Bottom 0.61: ARD_PRO_MINI.14 JP1.11
N$93
  Top 0.61: ARD_PRO_MINI.13 JP1.12
  Bottom 0.61: JP1.12 30.48,44.96
N$95
  Top 0.254: 66.93,45.47 66.93,42.8 68.2,41.53 HC165_CON2.7 68.2,40.77 68.2,40.64 65.53,37.97 65.53,34.04 66.42,33.15 67.56,33.15
  Top 0.406: 67.56,33.15 HC165-2.5 | 66.93,45.47 66.95,45.47 RN5.7
N$96
  Top 0.254: 67.82,45.59 67.82,45.47 67.82,43.81 HC165_CON2.8 69.47,42.16 69.47,40.26 68.83,39.62 68.07,39.62 66.04,37.59 66.04,34.42 67.56,34.42 | 67.69,34.42 HC165-2.6
  Top 0.406: HC165-2.6 67.56,34.42 | RN5.8 67.82,45.51 67.82,45.47
N$97
  Top 0.254: 55.12,45.59 55.12,45.47 55.12,43.81 HC165_CON1.8 56.77,42.16 56.77,40.26 56.13,39.62 55.37,39.62 53.34,37.59 53.34,34.42 54.86,34.42 HC165-1.6 54.99,34.42
  Top 0.406: RN3.8 55.12,45.51 55.12,45.47
TPIC0_SER_OUT
  Top 0.305: 34.8,19.05 TPIC0.18 TPIC1.3 40.89,19.05
TPIC1_SER_OUT
  Top 0.254: TPIC1.18 50.16,19.05
  Top 0.305: 50.16,19.05 TPIC2.3 56.13,19.05 56.26,19.05
TPIC2_SER_OUT
  Top 0.254: TPIC2.18 65.53,19.05
  Top 0.305: 65.53,19.05 TPIC3.3 71.5,19.05 71.63,19.05

### Text on the board
tPlace: 7 | 7 | 7 | 7 | Foivos Christoulakis | 2 | 4 | 6 | 4 | 2 | 2 | 4 | 2 | Arduino I/O Expander / Rev.2 - 2015 | 7
bPlace: GND | +12V